# EAGLE design cardedge_connector_breakout (EAGLE 8.4.0)
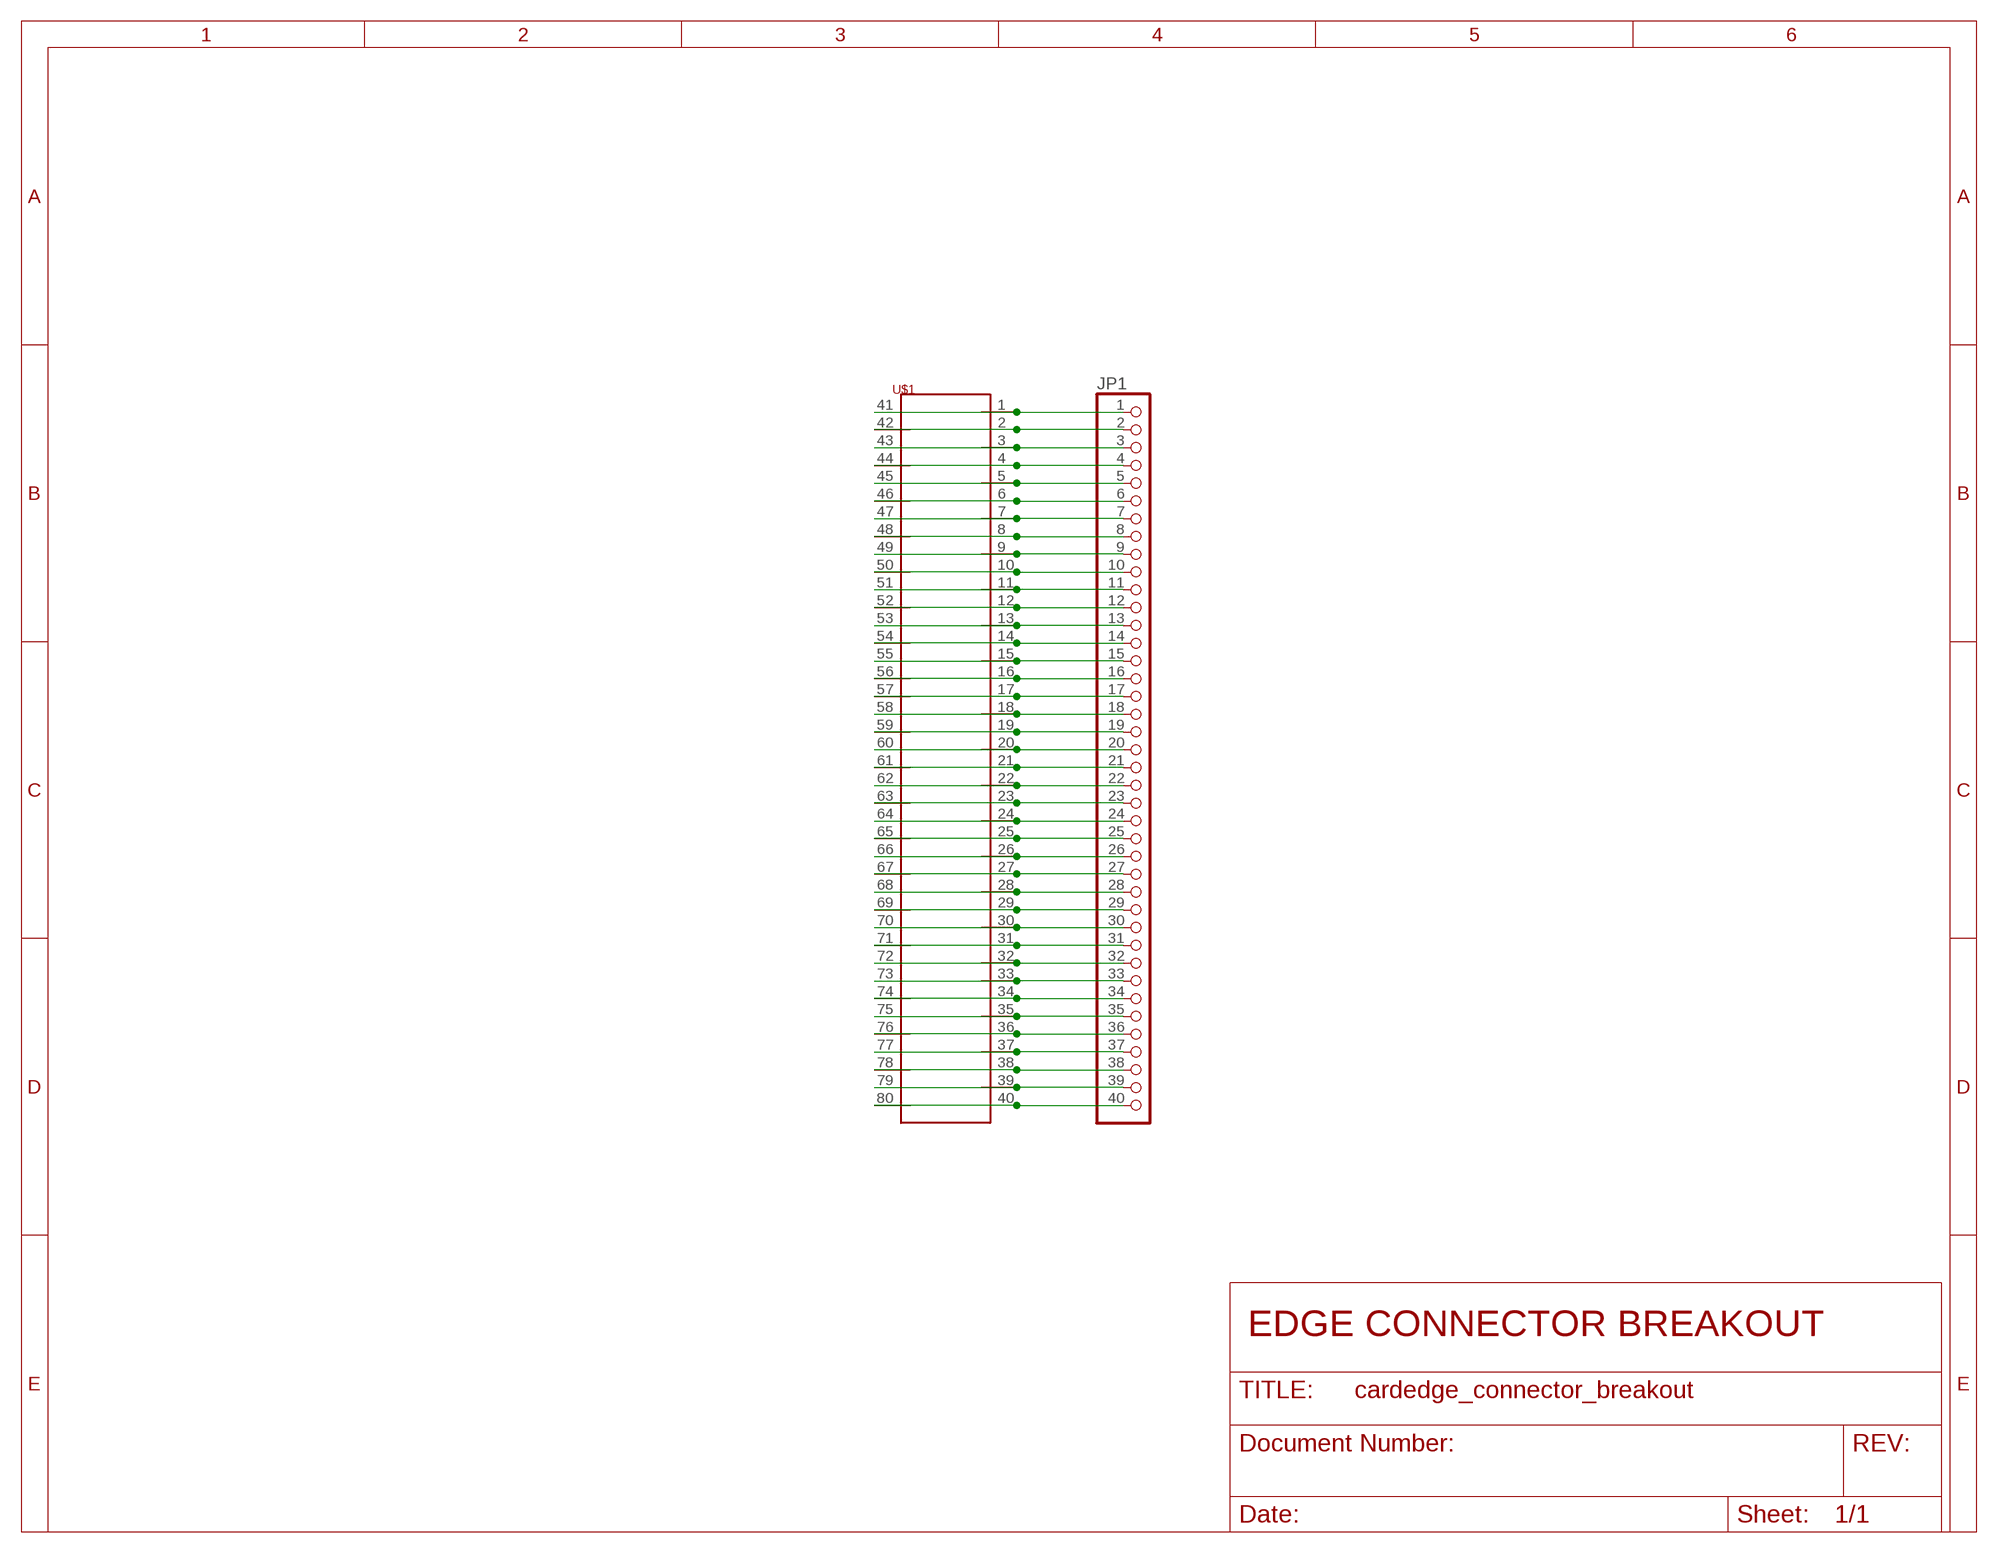
[diagram p0: schematic, sheet 1]

## Parts
JP1  PINHD-1X40  [1X40]
U$1  TE-2-5530843-0  [TE-2-5530843-0]
U$2  ILLINOISAUV  [ILLINOISAUV]  (not placed on a sheet)

## Nets
N$1: JP1.1 U$1.1 U$1.41
N$2: JP1.2 U$1.2 U$1.42
N$3: JP1.3 U$1.3 U$1.43
N$4: JP1.4 U$1.4 U$1.44
N$5: JP1.5 U$1.5 U$1.45
N$6: JP1.6 U$1.6 U$1.46
N$7: JP1.7 U$1.7 U$1.47
N$8: JP1.8 U$1.8 U$1.48
N$9: JP1.9 U$1.9 U$1.49
N$10: JP1.10 U$1.10 U$1.50
N$11: JP1.11 U$1.11 U$1.51
N$12: JP1.12 U$1.12 U$1.52
N$13: JP1.13 U$1.13 U$1.53
N$14: JP1.14 U$1.14 U$1.54
N$15: JP1.15 U$1.15 U$1.55
N$16: JP1.16 U$1.16 U$1.56
N$17: JP1.17 U$1.17 U$1.57
N$18: JP1.18 U$1.18 U$1.58
N$19: JP1.19 U$1.19 U$1.59
N$20: JP1.20 U$1.20 U$1.60
N$21: JP1.21 U$1.21 U$1.61
N$22: JP1.22 U$1.22 U$1.62
N$23: JP1.23 U$1.23 U$1.63
N$24: JP1.24 U$1.24 U$1.64
N$25: JP1.25 U$1.25 U$1.65
N$26: JP1.26 U$1.26 U$1.66
N$27: JP1.27 U$1.27 U$1.67
N$28: JP1.28 U$1.28 U$1.68
N$29: JP1.29 U$1.29 U$1.69
N$30: JP1.30 U$1.30 U$1.70
N$31: JP1.31 U$1.31 U$1.71
N$32: JP1.32 U$1.32 U$1.72
N$33: JP1.33 U$1.33 U$1.73
N$34: JP1.34 U$1.34 U$1.74
N$35: JP1.35 U$1.35 U$1.75
N$36: JP1.36 U$1.36 U$1.76
N$37: JP1.37 U$1.37 U$1.77
N$38: JP1.38 U$1.38 U$1.78
N$39: JP1.39 U$1.39 U$1.79
N$40: JP1.40 U$1.40 U$1.80

## Notes on the sheet
- EDGE CONNECTOR BREAKOUT

## Library data of the parts
JP1 = auv:PINHD-1X40: PIN HEADER
U$1 = auv:TE-2-5530843-0
U$2 = auv:ILLINOISAUV

## Board
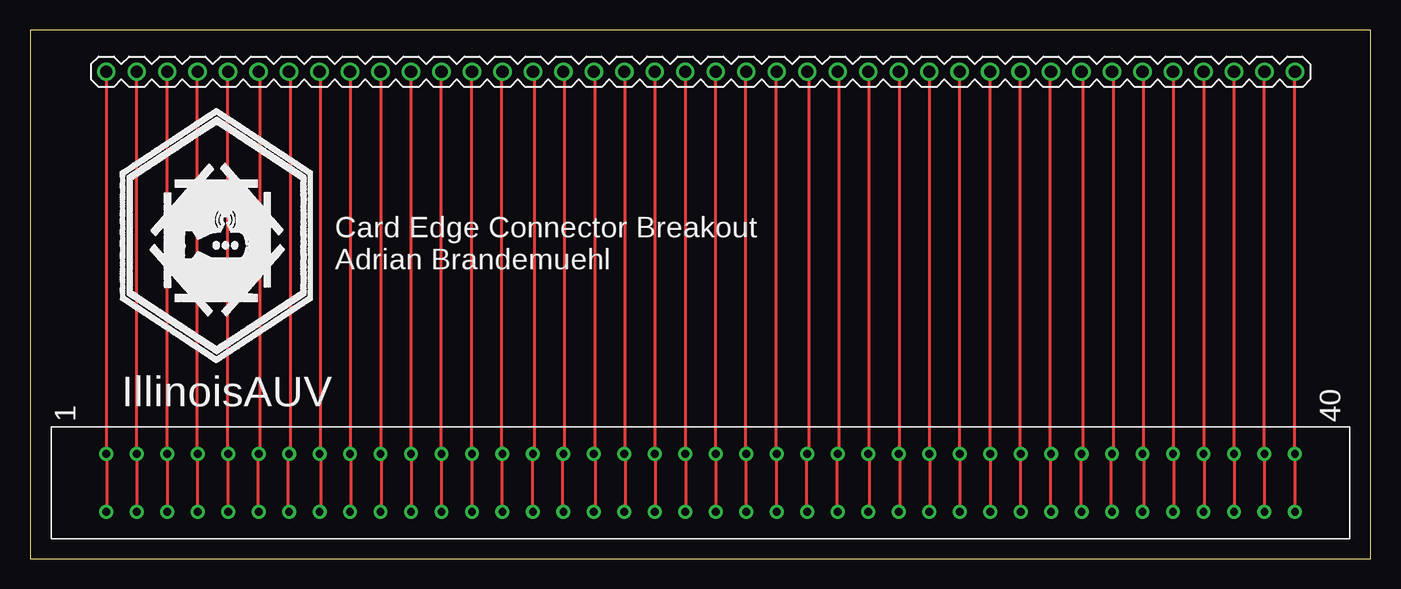
[diagram p1: board, top side]

Size 111.74 x 44.12 mm. Coordinates in mm from the lower left corner, seen from the top.
Outline: 0,0 111.74,0 111.74,44.12 0,44.12 0,0
Copper layers (1*16): Top 0.035mm / dielectric 1.5mm / Bottom 0.035mm
Design rules "default": minimum track width 10mil, minimum drill 24mil, track to track 8mil, track to pad 8mil, pad to pad 8mil, via to via 8mil, smd to smd 8mil, copper to edge 40mil, drill to drill 8mil, minimum pad ring 10mil, minimum via ring 8mil, stop-mask expansion 4mil, vias tented up to drill 0mil, thermal gap 10mil

### Footprints (pad centres in the part's own frame; a part is rotated, then mirrored left to right if it is on the bottom)
1X40 = drill 1.016: 1 -49.53,0; 2 -46.99,0; 3 -44.45,0; 4 -41.91,0; 5 -39.37,0; 6 -36.83,0; 7 -34.29,0; 8 -31.75,0; 9 -29.21,0; 10 -26.67,0; 11 -24.13,0; 12 -21.59,0; 13 -19.05,0; 14 -16.51,0; 15 -13.97,0; 16 -11.43,0; 17 -8.89,0; 18 -6.35,0; 19 -3.81,0; 20 -1.27,0; 21 1.27,0; 22 3.81,0; 23 6.35,0; 24 8.89,0; 25 11.43,0; 26 13.97,0; 27 16.51,0; 28 19.05,0; 29 21.59,0; 30 24.13,0; 31 26.67,0; 32 29.21,0; 33 31.75,0; 34 34.29,0; 35 36.83,0; 36 39.37,0; 37 41.91,0; 38 44.45,0; 39 46.99,0; 40 49.53,0
TE-2-5530843-0 = drill 0.65: 1 -49.53,2.426; 2 -46.99,2.426; 3 -44.45,2.426; 4 -41.91,2.426; 5 -39.37,2.426; 6 -36.83,2.426; 7 -34.29,2.426; 8 -31.75,2.426; 9 -29.21,2.426; 10 -26.67,2.426; 11 -24.13,2.426; 12 -21.59,2.426; 13 -19.05,2.426; 14 -16.51,2.426; 15 -13.97,2.426; 16 -11.43,2.426; 17 -8.89,2.426; 18 -6.35,2.426; 19 -3.81,2.426; 20 -1.27,2.426; 21 1.27,2.426; 22 3.81,2.426; 23 6.35,2.426; 24 8.89,2.426; 25 11.43,2.426; 26 13.97,2.426; 27 16.51,2.426; 28 19.05,2.426; 29 21.59,2.426; 30 24.13,2.426; 31 26.67,2.426; 32 29.21,2.426; 33 31.75,2.426; 34 34.29,2.426; 35 36.83,2.426; 36 39.37,2.426; 37 41.91,2.426; 38 44.45,2.426; 39 46.99,2.426; 40 49.53,2.426; 41 -49.53,-2.426; 42 -46.99,-2.426; 43 -44.45,-2.426; 44 -41.91,-2.426; 45 -39.37,-2.426; 46 -36.83,-2.426; 47 -34.29,-2.426; 48 -31.75,-2.426; 49 -29.21,-2.426; 50 -26.67,-2.426; 51 -24.13,-2.426; 52 -21.59,-2.426; 53 -19.05,-2.426; 54 -16.51,-2.426; 55 -13.97,-2.426; 56 -11.43,-2.426; 57 -8.89,-2.426; 58 -6.35,-2.426; 59 -3.81,-2.426; 60 -1.27,-2.426; 61 1.27,-2.426; 62 3.81,-2.426; 63 6.35,-2.426; 64 8.89,-2.426; 65 11.43,-2.426; 66 13.97,-2.426; 67 16.51,-2.426; 68 19.05,-2.426; 69 21.59,-2.426; 70 24.13,-2.426; 71 26.67,-2.426; 72 29.21,-2.426; 73 31.75,-2.426; 74 34.29,-2.426; 75 36.83,-2.426; 76 39.37,-2.426; 77 41.91,-2.426; 78 44.45,-2.426; 79 46.99,-2.426; 80 49.53,-2.426

### Placement (x,y rotation side)
JP1  55.88,40.64 0 top
U$1  55.88,6.35 0 top
U$2  16.51,25.4 0 top

### Tracks (layer width: path | path; a pad name or v marks a point on that pad's centre or on a via)
N$1
  Top 0.254: U$1.41 6.4,4.12 6.4,8.69 U$1.1 6.4,8.91 6.4,40.46 JP1.1
N$2
  Top 0.254: U$1.42 8.91,4.12 8.91,8.69 U$1.2 8.91,8.91 8.91,40.46 JP1.2
N$3
  Top 0.254: U$1.43 U$1.3 JP1.3
N$4
  Top 0.254: U$1.44 13.95,4.12 13.95,8.69 U$1.4 13.95,8.91 13.95,40.46 JP1.4
N$5
  Top 0.254: U$1.45 16.46,4.12 16.46,8.69 U$1.5 16.46,8.91 16.46,40.46 JP1.5
N$6
  Top 0.254: U$1.46 18.97,4.12 18.97,8.69 U$1.6 19.2,8.91 19.2,40.46 JP1.6
N$7
  Top 0.254: U$1.47 21.49,4.12 21.49,8.69 U$1.7 21.72,8.91 21.72,40.46 JP1.7
N$8
  Top 0.254: U$1.48 24.23,4.12 24.23,8.69 U$1.8 24.23,8.91 24.23,40.46 JP1.8
N$9
  Top 0.254: U$1.49 26.75,4.12 26.75,8.69 U$1.9 26.75,8.91 26.75,40.46 JP1.9
N$10
  Top 0.254: U$1.50 29.26,4.12 29.26,8.69 U$1.10 29.26,8.91 29.26,40.46 JP1.10
N$11
  Top 0.254: U$1.51 31.77,4.12 31.77,8.69 U$1.11 31.77,8.91 31.77,40.46 JP1.11
N$12
  Top 0.254: U$1.52 U$1.12 JP1.12
N$13
  Top 0.254: U$1.53 36.8,4.12 36.8,8.69 U$1.13 36.8,8.91 36.8,40.46 JP1.13
N$14
  Top 0.254: U$1.54 39.32,4.12 39.32,8.69 U$1.14 39.32,8.91 39.32,40.46 JP1.14
N$15
  Top 0.254: U$1.55 41.83,4.12 41.83,8.69 U$1.15 42.06,8.91 42.06,40.46 JP1.15
N$16
  Top 0.254: U$1.56 44.35,4.12 44.35,8.69 U$1.16 44.58,8.91 44.58,40.46 JP1.16
N$17
  Top 0.254: U$1.57 47.09,4.12 47.09,8.69 U$1.17 47.09,8.91 47.09,40.46 JP1.17
N$18
  Top 0.254: U$1.58 49.61,4.12 49.61,8.69 U$1.18 49.61,8.91 49.61,40.46 JP1.18
N$19
  Top 0.254: U$1.59 52.12,4.12 52.12,8.69 U$1.19 52.12,8.91 52.12,40.46 JP1.19
N$20
  Top 0.254: U$1.60 54.63,4.12 54.63,8.69 U$1.20 54.63,8.91 54.63,40.46 JP1.20
N$21
  Top 0.254: U$1.61 U$1.21 JP1.21
N$22
  Top 0.254: U$1.62 59.66,4.12 59.66,8.69 U$1.22 59.66,8.91 59.66,40.46 JP1.22
N$23
  Top 0.254: U$1.63 62.18,4.12 62.18,8.69 U$1.23 62.18,8.91 62.18,40.46 JP1.23
N$24
  Top 0.254: U$1.64 64.69,4.12 64.69,8.69 U$1.24 64.92,8.91 64.92,40.46 JP1.24
N$25
  Top 0.254: U$1.65 67.21,4.12 67.21,8.69 U$1.25 67.44,8.91 67.44,40.46 JP1.25
N$26
  Top 0.254: U$1.66 69.95,4.12 69.95,8.69 U$1.26 69.95,8.91 69.95,40.46 JP1.26
N$27
  Top 0.254: U$1.67 72.47,4.12 72.47,8.69 U$1.27 72.47,8.91 72.47,40.46 JP1.27
N$28
  Top 0.254: U$1.68 74.98,4.12 74.98,8.69 U$1.28 74.98,8.91 74.98,40.46 JP1.28
N$29
  Top 0.254: U$1.69 77.5,4.12 77.5,8.69 U$1.29 77.5,8.91 77.5,40.46 JP1.29
N$30
  Top 0.254: U$1.70 U$1.30 JP1.30
N$31
  Top 0.254: U$1.71 82.53,4.12 82.53,8.69 U$1.31 82.53,8.91 82.53,40.46 JP1.31
N$32
  Top 0.254: U$1.72 85.04,4.12 85.04,8.69 U$1.32 85.04,8.91 85.04,40.46 JP1.32
N$33
  Top 0.254: U$1.73 87.55,4.12 87.55,8.69 U$1.33 87.78,8.91 87.78,40.46 JP1.33
N$34
  Top 0.254: U$1.74 90.07,4.12 90.07,8.69 U$1.34 90.3,8.91 90.3,40.46 JP1.34
N$35
  Top 0.254: U$1.75 92.81,4.12 92.81,8.69 U$1.35 92.81,8.91 92.81,40.46 JP1.35
N$36
  Top 0.254: U$1.76 95.33,4.12 95.33,8.69 U$1.36 95.33,8.91 95.33,40.46 JP1.36
N$37
  Top 0.254: U$1.77 97.84,4.12 97.84,8.69 U$1.37 97.84,8.91 97.84,40.46 JP1.37
N$38
  Top 0.254: U$1.78 100.36,4.12 100.36,8.69 U$1.38 100.36,8.91 100.36,40.46 JP1.38
N$39
  Top 0.254: U$1.79 U$1.39 JP1.39
N$40
  Top 0.254: U$1.80 105.39,4.12 105.39,8.69 U$1.40 105.39,8.91 105.39,40.46 JP1.40

### Text on the board
tNames: Card Edge Connector Breakout / Adrian Brandemuehl | 1 | 40